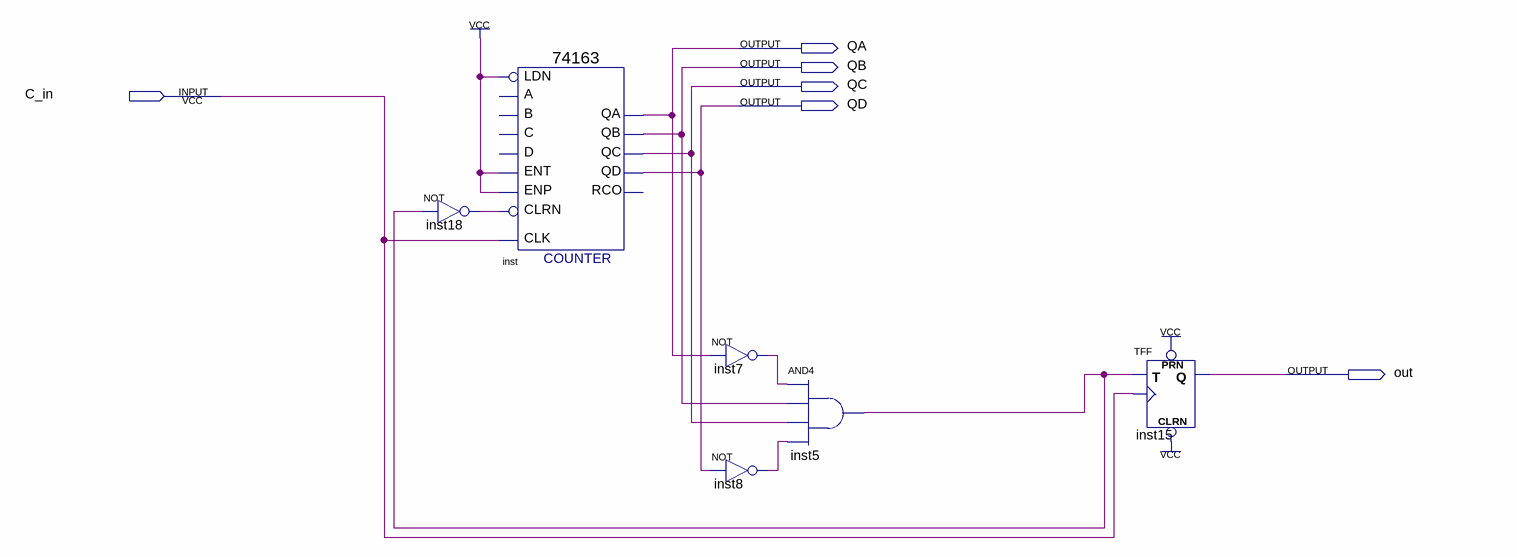
[diagram p0: schematic sheet]
// Quartus schematic Block1.bdf as structural Verilog: 6 symbols, 6 pins
module Block1 (
  input  C_in,
  output QA,
  output QB,
  output QC,
  output QD,
  output out
);

  wire inst5_out, inst7_out, inst8_out, inst18_out;

  not inst18 (inst18_out, inst5_out);
  \74163  inst (
    .ENT(1'b1), .CLRN(inst18_out), .CLK(C_in), .ENP(1'b1), .LDN(1'b1), .QA(QA), .QB(QB), .QC(QC), .QD(QD));  // open: C, B, A, D, RCO
  not inst7 (inst7_out, QA);
  not inst8 (inst8_out, QD);
  and inst5 (inst5_out, inst7_out, QB, QC, inst8_out);
  TFF inst15 (.PRN(1'b1), .CLRN(1'b1), .T(inst5_out), .CLK(C_in), .Q(out));
endmodule
